# EAGLE design untitled (EAGLE 5.06)
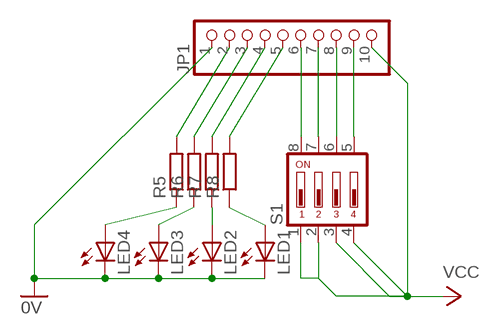
[diagram p0: schematic, sheet 1]

## Parts
JP1  PINHD-1X10  [1X10]
LED1  LED5MM  [LED5MM]
LED2  LED5MM  [LED5MM]
LED3  LED5MM  [LED5MM]
LED4  LED5MM  [LED5MM]
R5  R-EU_0207/10  [0207/10]
R6  R-EU_0207/10  [0207/10]
R7  R-EU_0207/10  [0207/10]
R8  R-EU_0207/10  [0207/10]
S1  DIP04YL  [DIP04YL]

## Nets
0V: JP1.1 LED1.K(C) LED2.K(C) LED3.K(C) LED4.K(C)
N$1: JP1.6 S1.8
N$2: JP1.7 S1.7
N$3: JP1.8 S1.6
N$4: JP1.9 S1.5
N$5: JP1.5 R8.2
N$6: LED1.A R8.1
N$7: JP1.4 R7.2
N$8: LED2.A R7.1
N$9: JP1.3 R6.2
N$10: LED3.A R6.1
N$11: JP1.2 R5.2
N$12: LED4.A R5.1
VCC: JP1.10 S1.1 S1.2 S1.3 S1.4

## Library data of the parts
JP1 = pinhead:PINHD-1X10: PIN HEADER
LED1-LED4 = led:LED: LED OSRAM: - CHIPLED LG R971, LG N971, LY N971, LG Q971, LY Q971, LO R971, LY R971 LH N974, LH R974 LS Q976, LO Q976, LY Q976 LO Q996 - Hyper CHIPLED LW Q18S LB Q993, LB Q99A, LB R99A - SideLED LS A670, LO A670, LY A670, LG A670, LP A670 LB A673, LV A673, LT A673, LW A673 LH A674 LY A675 LS A676, LA A676, LO A676, LY A676, LW A676 LS A679, LY A679, LG A679 - Hyper Micro SIDELED® LS Y876, LA Y876, LO Y876, LY Y876 LT Y87S - SmartLED LW L88C, LW L88S LB L89C, LB L89S, LG L890 LS L89K, LO L89K, LY L89K LS L896, LA L896, LO L896, LY L896 - TOPLED LS T670, LO T670, LY T670, LG T670, LP T670 LSG T670, LSP T670, LSY T670, LOP T670, LYG T670 LG T671, LOG T671, LSG T671 LB T673, LV T673, LT T673, LW T673 LH T674 LS T676, LA T676, LO T676, LY T676, LB T676, LH T676, LSB T676, LW T676 LB T67C, LV T67C, LT T67C, LS T67K, LO T67K, LY T67K, LW E67C LS E67B, LA E67B, LO E67B, LY E67B, LB E67C, LV E67C, LT E67C LW T67C LS T679, LY T679, LG T679 LS T770, LO T770, LY T770, LG T770, LP T770 LB T773, LV T773, LT T773, LW T773 LH T774 LS E675, LA E675, LY E675, LS T675 LS T776, LA T776, LO T776, LY T776, LB T776 LHGB T686 LT T68C, LB T68C - Hyper Mini TOPLED® LB M676 - Mini TOPLED Santana® LG M470 LS M47K, LO M47K, LY M47K Source: http://www.osram.convergy.de LUXEON: - LUMILED® LXK2-PW12-R00, LXK2-PW12-S00, LXK2-PW14-U00, LXK2-PW14-V00 LXK2-PM12-R00, LXK2-PM12-S00, LXK2-PM14-U00 LXK2-PE12-Q00, LXK2-PE12-R00, LXK2-PE12-S00, LXK2-PE14-T00, LXK2-PE14-U00 LXK2-PB12-K00, LXK2-PB12-L00, LXK2-PB12-M00, LXK2-PB14-N00, LXK2-PB14-P00, LXK2-PB14-Q00 LXK2-PR12-L00, LXK2-PR12-M00, LXK2-PR14-Q00, LXK2-PR14-R00 LXK2-PD12-Q00, LXK2-PD12-R00, LXK2-PD12-S00 LXK2-PH12-R00, LXK2-PH12-S00 LXK2-PL12-P00, LXK2-PL12-Q00, LXK2-PL12-R00 Source: www.luxeon.com KINGBRIGHT: KA-3528ASYC Source: www.kingbright.com
R5-R8 = resistor:R-EU_: RESISTOR, European symbol
S1 = switch-dil:DIP04YL: DIL/CODE SWITCH

## Board
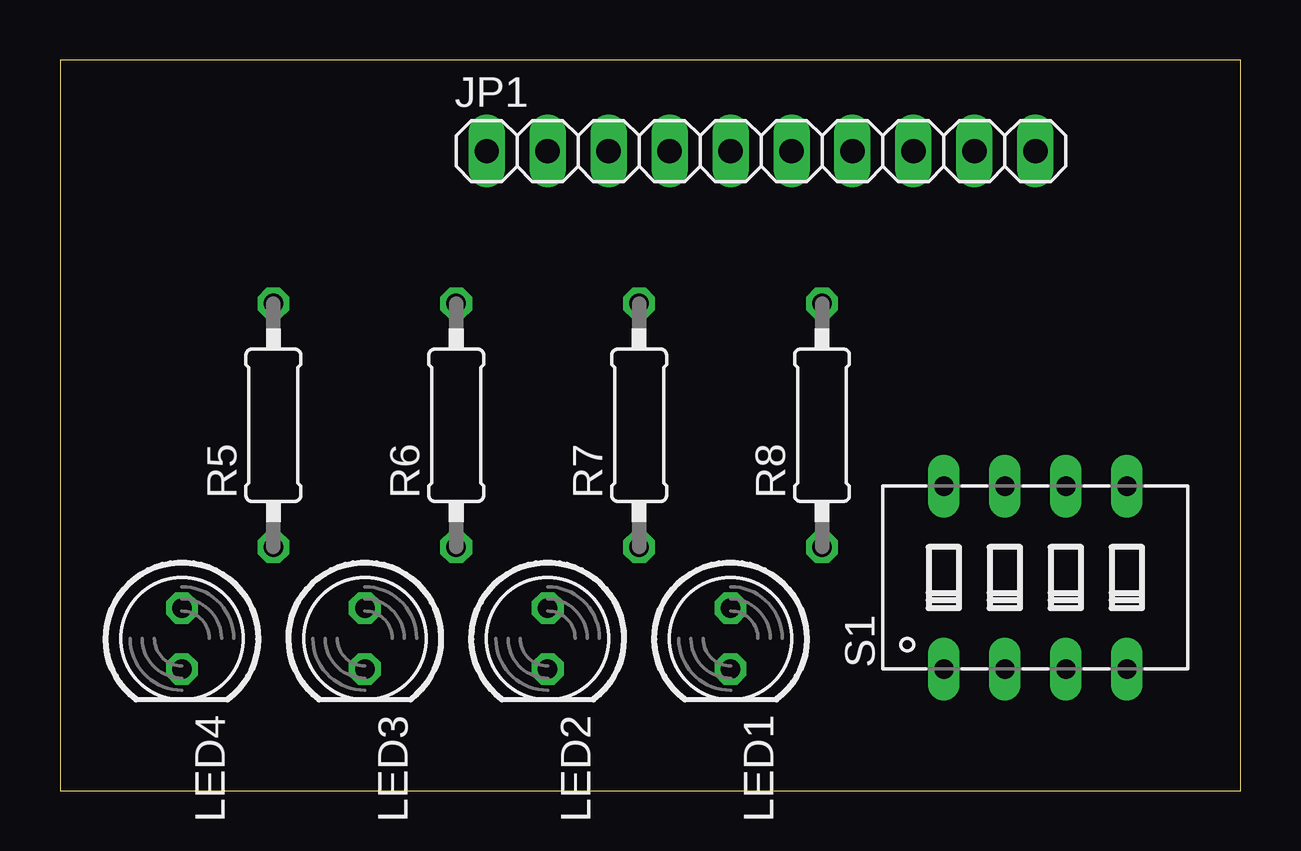
[diagram p1: board, top side]
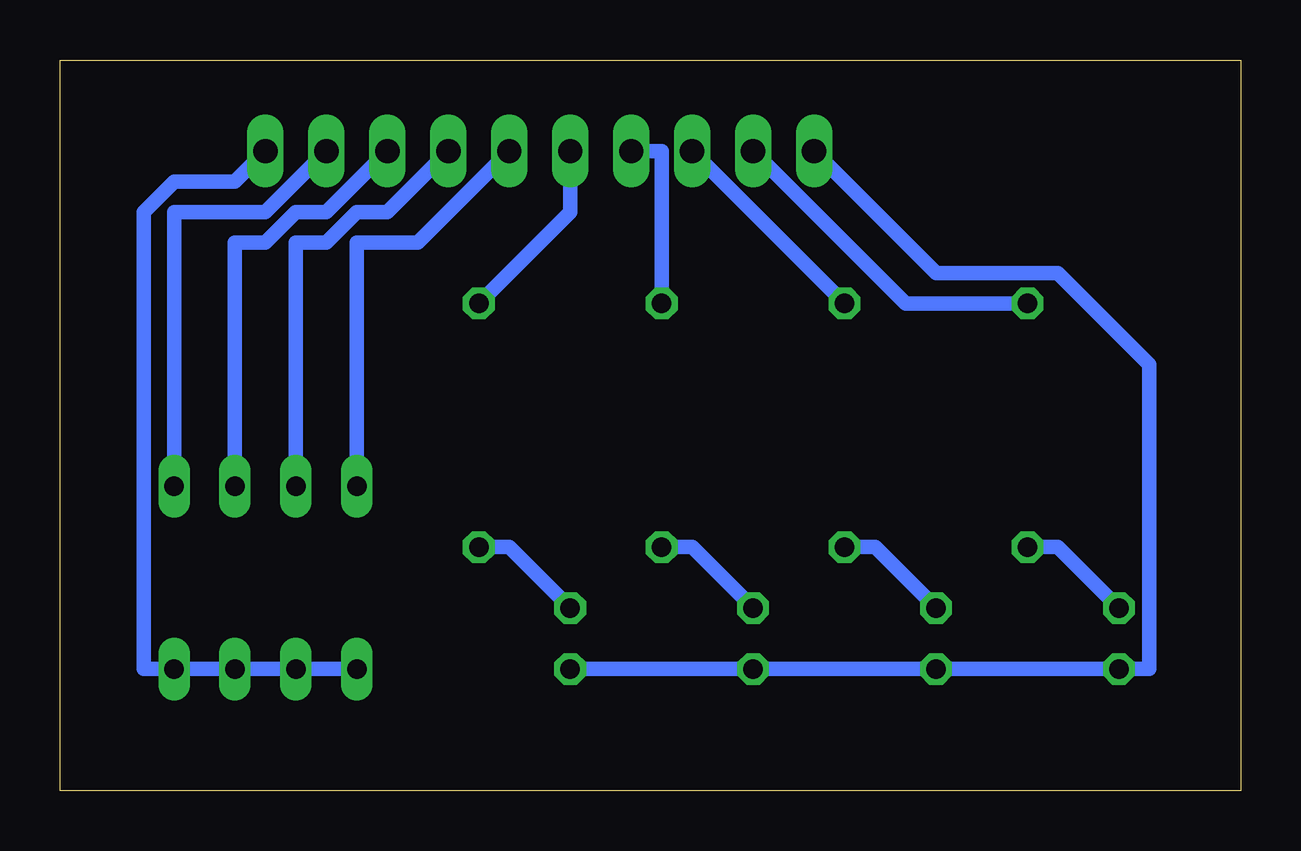
[diagram p2: board, bottom side, seen from below]

Size 49.2 x 30.47 mm. Coordinates in mm from the lower left corner, seen from the top.
Outline: 0,0 49.2,0 49.2,30.47 0,30.47 0,0
Copper layers (1*16): Top 0.035mm / dielectric 1.5mm / Bottom 0.035mm
Design rules "default": minimum track width 10mil, minimum drill 24mil, track to track 8mil, track to pad 8mil, pad to pad 8mil, via to via 8mil, smd to smd 8mil, copper to edge 40mil, drill to drill 8mil, minimum pad ring 10mil, minimum via ring 8mil, stop-mask expansion 4mil, vias tented up to drill 0mil, thermal gap 10mil

### Footprints (pad centres in the part's own frame; a part is rotated, then mirrored left to right if it is on the bottom)
1X10 = drill 1.016 long: 1 -11.43,0; 2 -8.89,0; 3 -6.35,0; 4 -3.81,0; 5 -1.27,0; 6 1.27,0; 7 3.81,0; 8 6.35,0; 9 8.89,0; 10 11.43,0
LED5MM = drill 0.813 octagon: A -1.27,0; K 1.27,0
0207/10 = drill 0.813 octagon: 1 -5.08,0; 2 5.08,0
DIP04YL = drill 0.813 long: 1 -3.81,-3.81; 2 -1.27,-3.81; 3 1.27,-3.81; 4 3.81,-3.81; 5 3.81,3.81; 6 1.27,3.81; 7 -1.27,3.81; 8 -3.81,3.81

### Placement (x,y rotation side)
JP1  29.21,26.67 0 top
LED1  27.94,6.35 270 top
LED2  20.32,6.35 270 top
LED3  12.7,6.35 270 top
LED4  5.08,6.35 270 top
R5  8.89,15.24 90 top
R6  16.51,15.24 90 top
R7  24.13,15.24 90 top
R8  31.75,15.24 90 top
S1  40.64,8.89 0 top

### Tracks (layer width: path | path; a pad name or v marks a point on that pad's centre or on a via)
0V
  Bottom 0.61: LED1.K LED2.K LED3.K LED4.K 3.81,5.08 3.81,17.78 7.62,21.59 12.7,21.59 JP1.1
N$1
  Bottom 0.61: S1.8 36.83,22.86 34.29,22.86 JP1.6
N$2
  Bottom 0.61: S1.7 39.37,22.86 38.1,22.86 36.83,24.13 35.56,24.13 JP1.7
N$3
  Bottom 0.61: S1.6 41.91,22.86 40.64,22.86 39.37,24.13 38.1,24.13 JP1.8
N$4
  Bottom 0.61: S1.5 44.45,24.13 40.64,24.13 JP1.9
N$5
  Bottom 0.61: R8.2 27.94,24.13 JP1.5
N$6
  Bottom 0.61: LED1.A 30.48,10.16 R8.1
N$7
  Bottom 0.61: R7.2 24.13,26.67 JP1.4
N$8
  Bottom 0.61: LED2.A 22.86,10.16 R7.1
N$9
  Bottom 0.61: R6.2 JP1.3
N$10
  Bottom 0.61: LED3.A 15.24,10.16 R6.1
N$11
  Bottom 0.61: R5.2 13.97,20.32 JP1.2
N$12
  Bottom 0.61: LED4.A 7.62,10.16 R5.1
VCC
  Bottom 0.61: S1.1 S1.2 S1.3 S1.4 45.72,5.08 45.72,24.13 44.45,25.4 41.91,25.4 JP1.10